# Altium schematic sheet CoinSensor _TLV333 v1.0.SchDoc
size A4
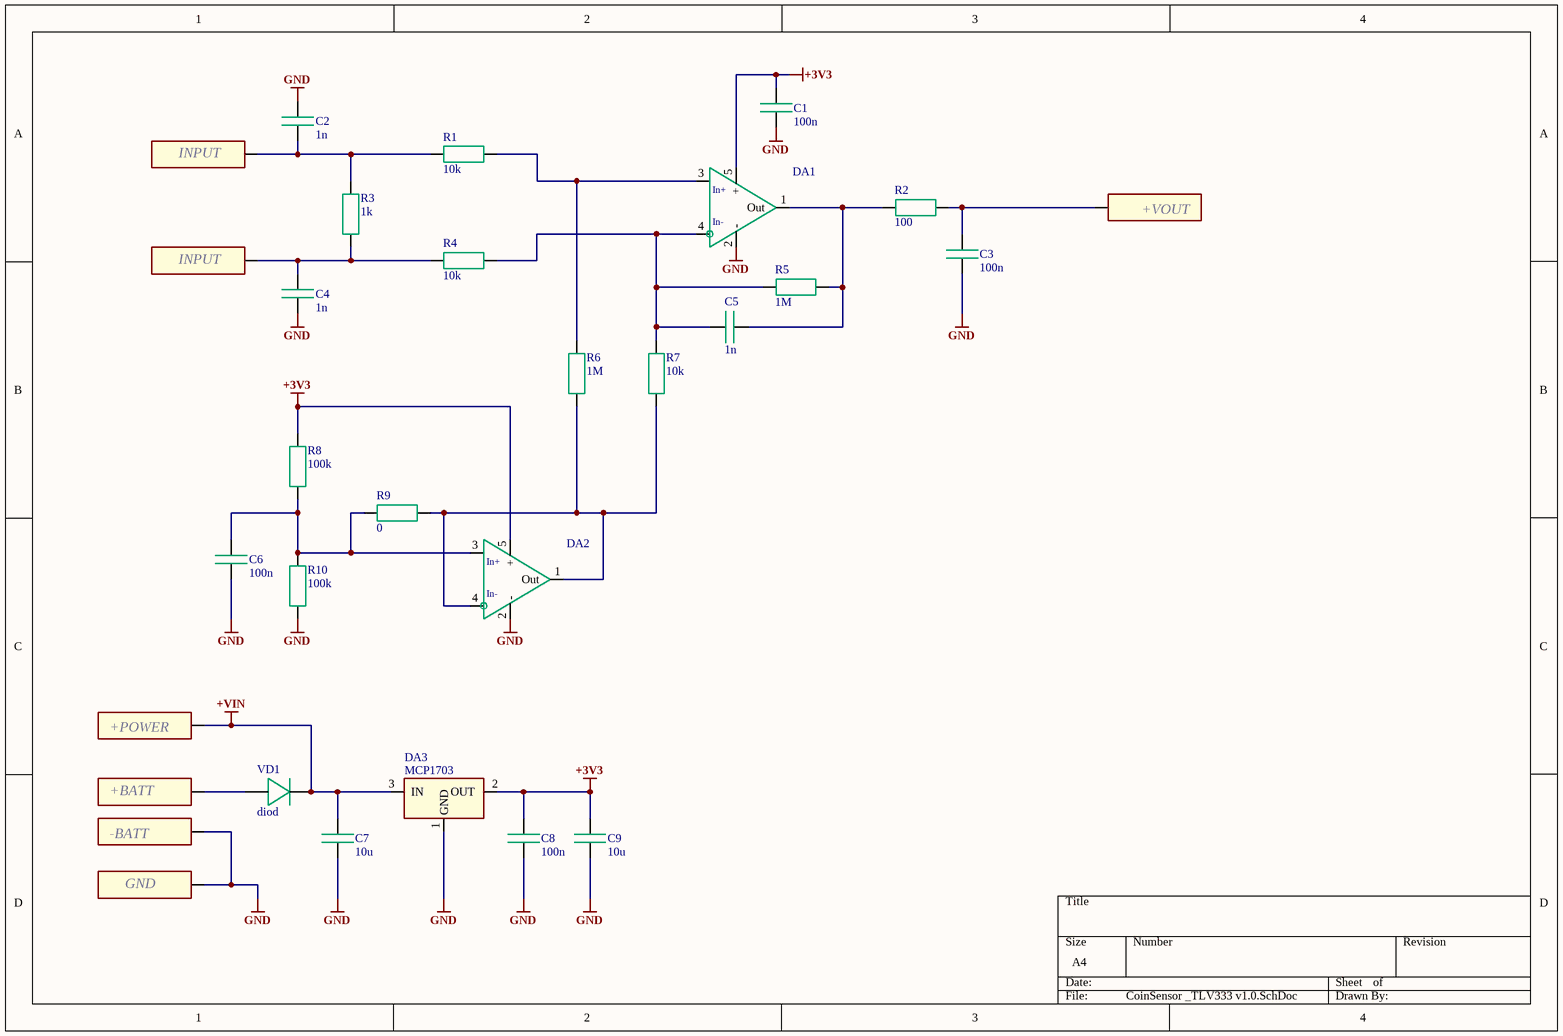
[diagram p0: CoinSensor _TLV333 v1.0.SchDoc]

## Parts
C1  100n  [CAP 0603]
C2  1n  [CAP 0603]
C3  100n  [CAP 0603]
C4  1n  [CAP 0603]
C5  1n  [CAP 0603]
C6  100n  [CAP 0603]
C7  10u  [CAP 0603]
C8  100n  [CAP 0603]
C9  10u  [CAP 0603]
DA1  TLV333IDBVR  [SOT-23-5]  (value not drawn)
DA2  TLV333IDBVR  [SOT-23-5]  (value not drawn)
DA3  MCP1703  [SOT-23A]
R1  10k  [RES 0603]
R2  100  [RES 0603]
R3  1k  [RES 0603]
R4  10k  [RES 0603]
R5  1M  [RES 0603]
R6  1M  [RES 0603]
R7  10k  [RES 0603]
R8  100k  [RES 0603]
R9  0  [RES 0603]
R10  100k  [RES 0603]
VD1  diod  [SOD-323]
X1  INPUT  [PLS-1]  (no BOM)
X2  +VOUT  [PLS-1]  (no BOM)
X3  INPUT  [PLS-1]  (no BOM)
X4  Name: +POWER  [PLS-1]  (hidden comment: +VIN)  (no BOM)
X5  +BATT  [PLS-1]  (no BOM)
X6  -BATT  [PLS-1]  (no BOM)
X7  GND  [PLS-1]  (no BOM)

## Nets
+3V3: C1.2 C8.2 C9.2 DA1.5(+) DA2.5(+) DA3.2(OUT) R8.1
+VIN: C7.2 DA3.3(IN) VD1.1 X4.1
GND: C1.1 C2.2 C3.2 C4.1 C6.1 C7.1 C8.1 C9.1 DA1.2(-) DA2.2(-) DA3.1(GND) R10.2 X6.1 X7.1
NetC2_1: C2.1 R1.2 R3.1 X1.1
NetC3_1: C3.1 R2.1 X2.1
NetC4_2: C4.2 R3.2 R4.2 X3.1
NetC5_1: C5.1 DA1.4 R4.1 R5.1 R7.2
NetC5_2: C5.2 DA1.1(Out) R2.2 R5.2
NetC6_2: C6.2 DA2.3 R8.2 R9.1 R10.1
NetDA1_3: DA1.3 R1.1 R6.2
NetDA2_1: DA2.1(Out) DA2.4 R6.1 R7.1 R9.2
NetVD1_2: VD1.2 X5.1

## Notes on the sheet
- (in symbol TLV333IDBVR) In+; In-

## Library data of the parts
C1 C3 C6 C8 = Cap 0603: Ceramic capacitor, SMD; Manufacturer: Samsung; Manufacturer P/N: C14663; Tolerance: ±10%; Корпус: 0603; Комментарий: Конденсатор керамический, SMD; ID: Cap 0603; Type: Capacitor; Temperature: -55…+125; HelpURL: pdf/passive/samsung-chip-cap.pdf
C2 C4 C5 = Cap 0603: Ceramic capacitor, SMD; Manufacturer: Samsung; Manufacturer P/N: C1588; Tolerance: ±10%; Корпус: 0603; Комментарий: Конденсатор керамический, SMD; ID: Cap 0603; Type: Capacitor; Temperature: -55…+125; HelpURL: pdf/passive/samsung-chip-cap.pdf
C7 C9 = Cap 0603: Ceramic capacitor, SMD; Manufacturer: Samsung; Manufacturer P/N: C19702; Tolerance: ±10%; Корпус: 0603; Комментарий: Конденсатор керамический, SMD; ID: Cap 0603; Type: Capacitor; Temperature: -55…+125; HelpURL: pdf/passive/samsung-chip-cap.pdf
DA1 DA2 = TLV333IDBVR: Operation Amplifier, rail-to-rail; Manufacturer: Texas Instruments; Manufacturer P/N: C75209; Vcc min: 1.8V; Vcc max: 5.5V; Freq max: 350kHz; Комментарий: ОУ общего назначения, rail-to-rail вход-выход; ID: TLV333IDBVR; Type: OpAmp; Temperature: -40…+125; Digikey p/n: 296-43777-1-ND; Корпус: SOT-23-5
DA3 = MCP1703: Voltage regulator, linear; Manufacturer: Microchip; Manufacturer P/N: C39051; Vcc min: 2.7V; Vcc max: 16V; Iout max: 0.25A; Корпус: SOT-23; Комментарий: Линейный стабилизатор; ID: MCP1703; Type: linear regulator; Temperature: -40…+125; HelpURL: pdf/ica/MCP1703.pdf
R1 R4 R7 = Res 0603: Chip resistor, SMD; Manufacturer: Samsung; Manufacturer P/N: C25804; Tolerance: 5%; Power: 0.1W; Max Voltage: 50V; Корпус: 0603; Комментарий: Резистор постоянный, SMD; ID: Res 0603; Type: Resistor; Temperature: -55…+155; HelpURL: pdf/passive/Samsung-RC3216J101CS.pdf; ComponentLink1URL: pdf/passive/Samsung-RC3216J101CS.pdf; ComponentLink1Description: Samsung Datasheet
R2 = Res 0603: Chip resistor, SMD; Manufacturer: Samsung; Manufacturer P/N: C22775; Tolerance: 5%; Power: 0.1W; Max Voltage: 50V; Корпус: 0603; Комментарий: Резистор постоянный, SMD; ID: Res 0603; Type: Resistor; Temperature: -55…+155; HelpURL: pdf/passive/Samsung-RC3216J101CS.pdf; ComponentLink1URL: pdf/passive/Samsung-RC3216J101CS.pdf; ComponentLink1Description: Samsung Datasheet
R3 = Res 0603: Chip resistor, SMD; Manufacturer: Samsung; Manufacturer P/N: C21190; Tolerance: 5%; Power: 0.1W; Max Voltage: 50V; Корпус: 0603; Комментарий: Резистор постоянный, SMD; ID: Res 0603; Type: Resistor; Temperature: -55…+155; HelpURL: pdf/passive/Samsung-RC3216J101CS.pdf; ComponentLink1URL: pdf/passive/Samsung-RC3216J101CS.pdf; ComponentLink1Description: Samsung Datasheet
R5 R6 = Res 0603: Chip resistor, SMD; Manufacturer: Samsung; Manufacturer P/N: C22935; Tolerance: 5%; Power: 0.1W; Max Voltage: 50V; Корпус: 0603; Комментарий: Резистор постоянный, SMD; ID: Res 0603; Type: Resistor; Temperature: -55…+155; HelpURL: pdf/passive/Samsung-RC3216J101CS.pdf; ComponentLink1URL: pdf/passive/Samsung-RC3216J101CS.pdf; ComponentLink1Description: Samsung Datasheet
R8 R10 = Res 0603: Chip resistor, SMD; Manufacturer: Samsung; Manufacturer P/N: C25803; Tolerance: 5%; Power: 0.1W; Max Voltage: 50V; Корпус: 0603; Комментарий: Резистор постоянный, SMD; ID: Res 0603; Type: Resistor; Temperature: -55…+155; HelpURL: pdf/passive/Samsung-RC3216J101CS.pdf; ComponentLink1URL: pdf/passive/Samsung-RC3216J101CS.pdf; ComponentLink1Description: Samsung Datasheet
R9 = Res 0603: Chip resistor, SMD; Manufacturer: Samsung; Manufacturer P/N: C21189; Tolerance: 5%; Power: 0.1W; Max Voltage: 50V; Корпус: 0603; Комментарий: Резистор постоянный, SMD; ID: Res 0603; Type: Resistor; Temperature: -55…+155; HelpURL: pdf/passive/Samsung-RC3216J101CS.pdf; ComponentLink1URL: pdf/passive/Samsung-RC3216J101CS.pdf; ComponentLink1Description: Samsung Datasheet
VD1 = RB751V40T1G: Diode schottky; Manufacturer: ON Semiconductor; Manufacturer P/N: C191023; Voltage: 30V; Voltage max: 40V; Комментарий: Диод Шоттки; ID: RB751V40T1G; Type: diod; HelpURL: pdf/discrete/RB751V40T1G.pdf; Digikey p/n: RB751V40T1GOSCT-ND; Корпус: SOD-323
X1-X7 = IN-OUT pin: Manufacturer: KHADB; ID: IN-OUT pin
  X1 X3: Name: INPUT
  X2: Name: +VOUT
  X5: Name: +BATT
  X6: Name: -BATT
  X7: Name: GND